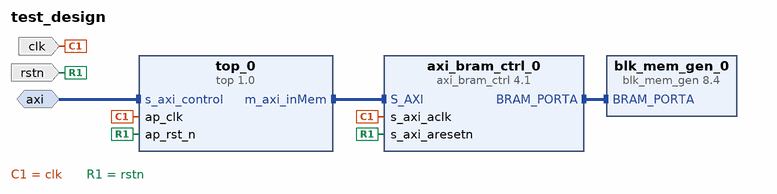
[diagram p0: block diagram of the top level]
# Vivado block design test_design, xc7a100tcsg324-1, Vivado 2021.1
create_bd_design test_design

create_bd_intf_port -mode Slave -vlnv xilinx.com:interface:aximm_rtl:1.0 axi
set_property -dict [list \
  CONFIG.ADDR_WIDTH 32 \
  CONFIG.ARUSER_WIDTH 0 \
  CONFIG.AWUSER_WIDTH 0 \
  CONFIG.BUSER_WIDTH 0 \
  CONFIG.DATA_WIDTH 32 \
  CONFIG.FREQ_HZ 20000000 \
  CONFIG.HAS_BRESP 1 \
  CONFIG.HAS_BURST 1 \
  CONFIG.HAS_CACHE 1 \
  CONFIG.HAS_LOCK 1 \
  CONFIG.HAS_PROT 1 \
  CONFIG.HAS_QOS 1 \
  CONFIG.HAS_REGION 1 \
  CONFIG.HAS_RRESP 1 \
  CONFIG.HAS_WSTRB 1 \
  CONFIG.ID_WIDTH 0 \
  CONFIG.MAX_BURST_LENGTH 1 \
  CONFIG.NUM_READ_OUTSTANDING 1 \
  CONFIG.NUM_READ_THREADS 1 \
  CONFIG.NUM_WRITE_OUTSTANDING 1 \
  CONFIG.NUM_WRITE_THREADS 1 \
  CONFIG.PROTOCOL AXI4LITE \
  CONFIG.READ_WRITE_MODE READ_WRITE \
  CONFIG.RUSER_BITS_PER_BYTE 0 \
  CONFIG.RUSER_WIDTH 0 \
  CONFIG.SUPPORTS_NARROW_BURST 0 \
  CONFIG.WUSER_BITS_PER_BYTE 0 \
  CONFIG.WUSER_WIDTH 0 \
] [get_bd_intf_ports axi]
create_bd_port -dir I -type rst rstn
create_bd_port -dir I -type clk clk
set_property -dict {CONFIG.FREQ_HZ 20000000} [get_bd_ports clk]

create_bd_cell -type ip -vlnv xilinx.com:hls:top:1.0 top_0
create_bd_cell -type ip -vlnv xilinx.com:ip:axi_bram_ctrl:4.1 axi_bram_ctrl_0
set_property -dict {CONFIG.SINGLE_PORT_BRAM 1} [get_bd_cells axi_bram_ctrl_0]
create_bd_cell -type ip -vlnv xilinx.com:ip:blk_mem_gen:8.4 blk_mem_gen_0

# ---- connections ----

connect_bd_intf_net [get_bd_intf_ports axi] [get_bd_intf_pins top_0/s_axi_control]
connect_bd_intf_net [get_bd_intf_pins axi_bram_ctrl_0/BRAM_PORTA] [get_bd_intf_pins blk_mem_gen_0/BRAM_PORTA]
connect_bd_intf_net [get_bd_intf_pins top_0/m_axi_inMem] [get_bd_intf_pins axi_bram_ctrl_0/S_AXI]
connect_bd_net [get_bd_ports clk] [get_bd_pins top_0/ap_clk] [get_bd_pins axi_bram_ctrl_0/s_axi_aclk]
connect_bd_net [get_bd_ports rstn] [get_bd_pins top_0/ap_rst_n] [get_bd_pins axi_bram_ctrl_0/s_axi_aresetn]

# ---- address map ----
assign_bd_address -offset 0x40020000 -range 128 -target_address_space [get_bd_addr_spaces axi] [get_bd_addr_segs top_0/s_axi_control/Reg]
assign_bd_address -offset 0x40028000 -range 8K -target_address_space [get_bd_addr_spaces top_0/Data_m_axi_inMem] [get_bd_addr_segs axi_bram_ctrl_0/S_AXI/Mem0]

validate_bd_design
save_bd_design
